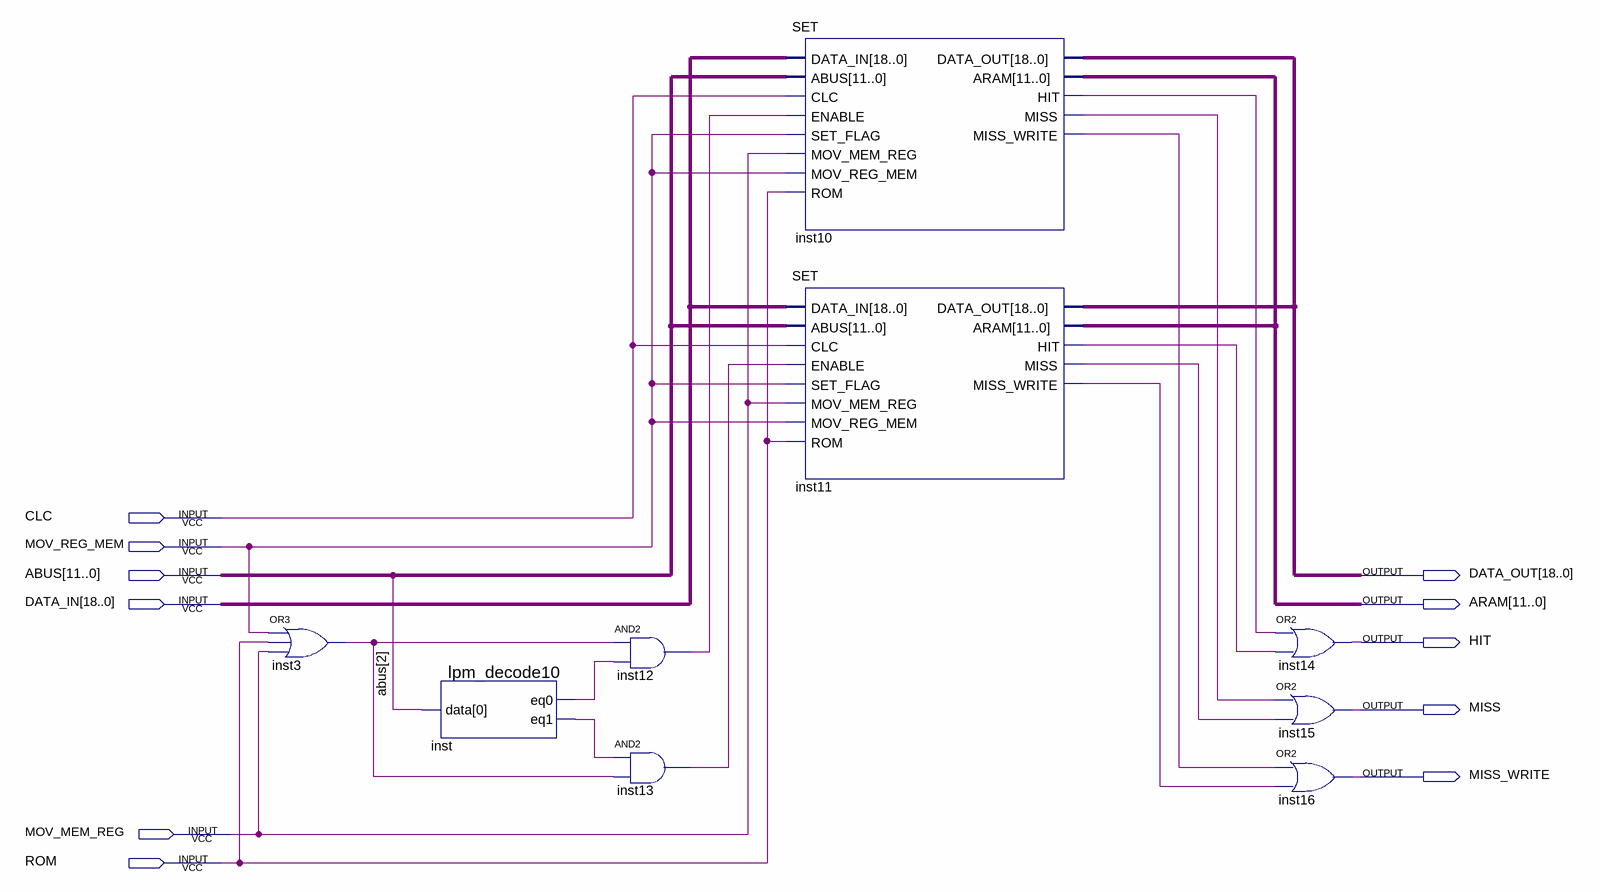
[diagram p0: schematic sheet]
// Quartus schematic CASH.bdf as structural Verilog: 9 symbols, 11 pins
module CASH (
  input  CLC,
  input  MOV_REG_MEM,
  input  [11:0] ABUS,
  input  [18:0] DATA_IN,
  input  MOV_MEM_REG,
  input  ROM,
  output [18:0] DATA_OUT,
  output [11:0] ARAM,
  output HIT,
  output MISS,
  output MISS_WRITE
);

  wire inst3_out, inst10_hit, inst10_miss, inst10_miss_write, inst11_hit, inst11_miss, inst11_miss_write,
       inst12_out, inst13_out, inst_eq0, inst_eq1;

  or inst3 (inst3_out, MOV_REG_MEM, ROM, MOV_MEM_REG);
  lpm_decode10 inst (.data(ABUS[2]), .eq0(inst_eq0), .eq1(inst_eq1));
  and inst12 (inst12_out, inst3_out, inst_eq0);
  and inst13 (inst13_out, inst_eq1, inst3_out);
  SET inst10 (
    .DATA_IN(DATA_IN), .ABUS(ABUS), .CLC(CLC), .ENABLE(inst12_out), .SET_FLAG(MOV_REG_MEM),
    .MOV_MEM_REG(MOV_MEM_REG), .MOV_REG_MEM(MOV_REG_MEM), .ROM(ROM), .DATA_OUT(DATA_OUT), .ARAM(ARAM),
    .HIT(inst10_hit), .MISS(inst10_miss), .MISS_WRITE(inst10_miss_write));
  SET inst11 (
    .DATA_IN(DATA_IN), .ABUS(ABUS), .CLC(CLC), .ENABLE(inst13_out), .SET_FLAG(MOV_REG_MEM),
    .MOV_MEM_REG(MOV_MEM_REG), .MOV_REG_MEM(MOV_REG_MEM), .ROM(ROM), .DATA_OUT(DATA_OUT), .ARAM(ARAM),
    .HIT(inst11_hit), .MISS(inst11_miss), .MISS_WRITE(inst11_miss_write));
  or inst14 (HIT, inst10_hit, inst11_hit);
  or inst15 (MISS, inst10_miss, inst11_miss);
  or inst16 (MISS_WRITE, inst10_miss_write, inst11_miss_write);
endmodule
